# EAGLE design counter-defender-featherwing-mk-1.1 (EAGLE 7.5.0)
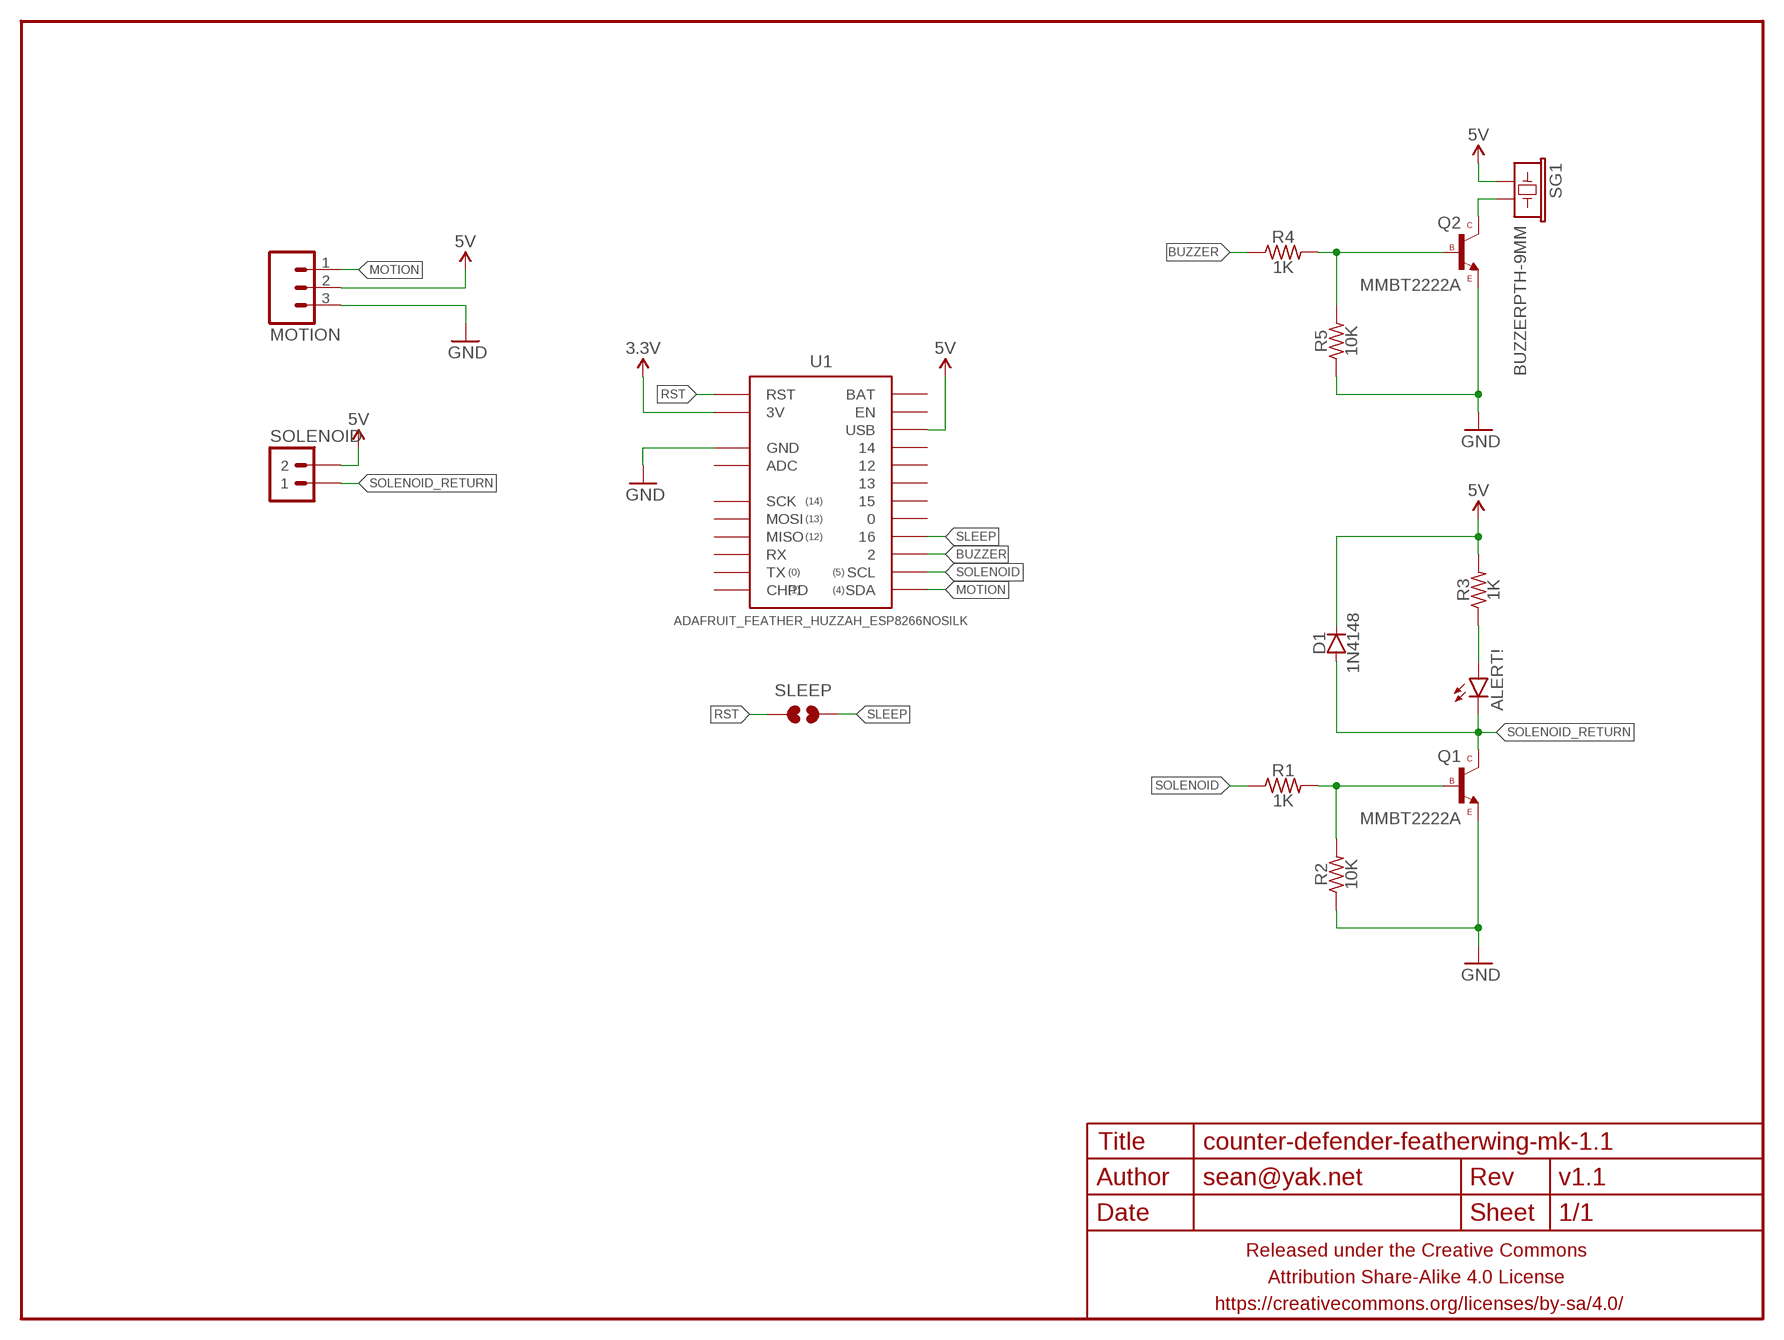
[diagram p0: schematic, sheet 1]

## Parts
ALERT!  LED0603-TIGHT  [LED-0603-TIGHT]
D1  1N4148  DIODESOD123  [SOD123]
FRAME1  FRAME-LETTERNO_PACKAGE  [DUMMY]
MOTION  M03PTH-CENTERED  [1X03-CENTERED]
Q1  MMBT2222A  TRANSISTOR_NPNMMBT2222A  [SOT23]
Q2  MMBT2222A  TRANSISTOR_NPNMMBT2222A  [SOT23]
R1  1K  RESISTORR0603-TIGHTER  [R0603-TIGHTER]
R2  10K  RESISTORR0603-TIGHTER  [R0603-TIGHTER]
R3  1K  RESISTORR0603-TIGHTER  [R0603-TIGHTER]
R4  1K  RESISTORR0603-TIGHTER  [R0603-TIGHTER]
R5  10K  RESISTORR0603-TIGHTER  [R0603-TIGHTER]
SG1  BUZZERPTH-9MM  [BUZZER-PTH-9MM]
SLEEP  JUMPER-PAD-2-NOYES_SILK  [PAD-JUMPER-2-NO_YES_SILK]
SOLENOID  M02PTH-CENTERED  [1X02-CENTER]
U1  ADAFRUIT_FEATHER_HUZZAH_ESP8266NOSILK  [ADAFRUIT_FEATHER_HUZZAH_NOSILK]

## Nets
3.3V: U1.3V
5V: D1.C MOTION.2 R3.2 SG1.+ SOLENOID.2 U1.USB
BUZZER: R4.1 U1.2
GND: MOTION.3 Q1.2(E) Q2.2(E) R2.1 R5.1 U1.GND@0(GND)
MOTION: MOTION.1 U1.SDA
N$1: ALERT!.A R3.1
N$2: Q1.1(B) R1.2 R2.2
N$3: Q2.3(C) SG1.-
N$5: Q2.1(B) R4.2 R5.2
RST: SLEEP.1 U1.RST
SLEEP: SLEEP.2 U1.16
SOLENOID: R1.1 U1.SCL
SOLENOID_RETURN: ALERT!.C D1.A Q1.3(C) SOLENOID.1
Unconnected: U1.0 U1.12 U1.13 U1.14 U1.15 U1.ADC U1.BAT U1.CHPD U1.EN U1.MISO U1.MOSI U1.RX U1.SCK U1.TX

## Library data of the parts
ALERT! = a_parts:LED: LEDs Standard schematic elements and footprints for 5mm, 3mm, 1206, and 0603 sized LEDs. 5mm - Spark Fun Electronics SKU : COM-00529 (and others)
D1 = a_parts:DIODE: Diode These are standard reverse protection diodes and small signal diodes. SMA package can handle up to about 1A. SOD-323 can handle about 200mA. What the SOD-323 package when ordering, there are some mfgs out there that are 5-pin packages.
FRAME1 = a_parts:FRAME-LETTER: Schematic Frame Standard 8.5x11 US Letter frame; DESIGNER: sean@yak.net; VERSION: v1.1
MOTION = a_parts:M03: Header 3 Standard 3-pin 0.1" header. Use with straight break away headers (SKU : PRT-00116), right angle break away headers (PRT-00553), swiss pins (PRT-00743), machine pins (PRT-00117), and female headers (PRT-00115). Molex polarized connector foot print use with SKU : PRT-08232 with associated crimp pins and housings.
Q1 Q2 = a_parts:TRANSISTOR_NPN: Generic NPN BJT MMBT2222A - TRANS-08049 (SOT-23, 1A 40V) MPSA42 - TRANS-09116 (SOT-23, 500mA 300V) MMBT5088LT1G - TRANS-11160 (SOT-23, 50 mA 30V) BC547 - COM-08928 <http://www.sparkfun.com/products/8928> (TO-92 45V 100mA) (1.Collector 2.Base 3.Emitter) 2N3904 - COM-00521 <http://www.sparkfun.com/products/521> (TO-92 40V 200mA) (1.Emitter 2.Base 3.Collector) P2N2222A - COM-12852 <http://www.sparkfun.com/products/12852> (TO-92 40V 600mA) (1.Collector 2.Base 3.Emitter)
R1-R5 = a_parts:RESISTOR: RESISTOR, American symbol
SG1 = a_parts:BUZZER: Buzzer 12mm Spark Fun Electronics SKU : Comp-Buzzer
SLEEP = a_parts:JUMPER-PAD-2-NO
SOLENOID = a_parts:M02: Standard 2-pin 0.1" header. Use with - straight break away headers ( PRT-00116) - right angle break away headers (PRT-00553) - swiss pins (PRT-00743) - machine pins (PRT-00117) - female headers (PRT-00115) Molex polarized connector foot print use with: PRT-08233 with associated crimp pins and housings. 2.54_SCREWTERM for use with PRT-10571. 3.5mm Screw Terminal footprints for PRT-08084 5mm Screw Terminal footprints for use with PRT-08433
U1 = a_parts:ADAFRUIT_FEATHER_HUZZAH_ESP8266

## Board
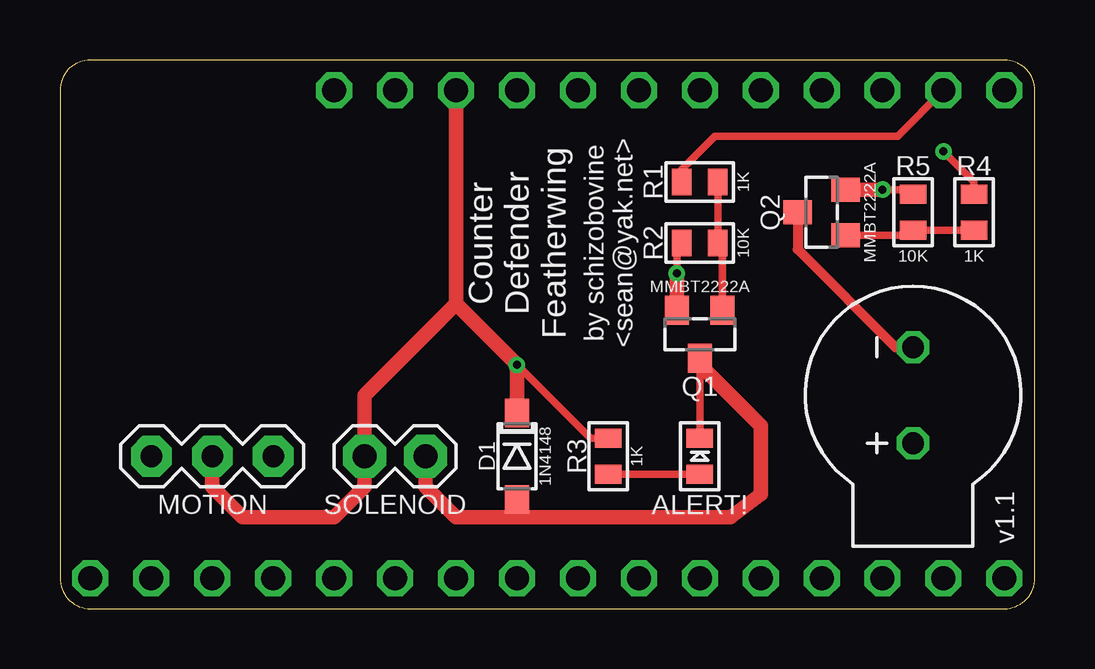
[diagram p1: board, top side]
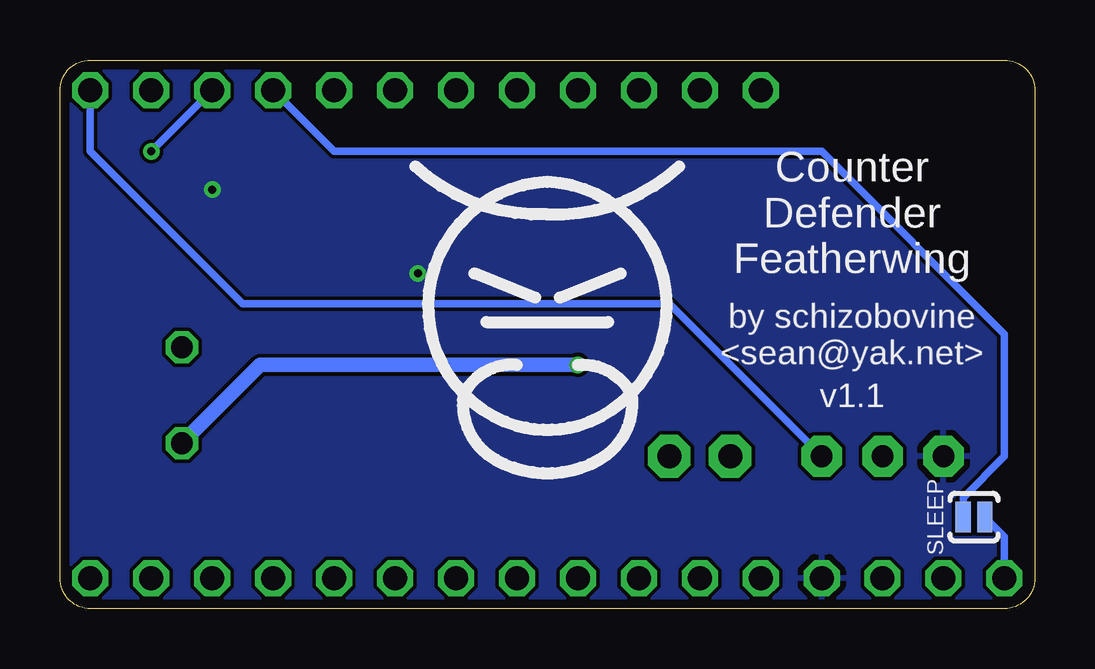
[diagram p2: board, bottom side, seen from below]

Size 40.64 x 22.86 mm. Coordinates in mm from the lower left corner, seen from the top.
Outline: 40.64,1.27 40.64,21.59 arc90 39.37,22.86 1.27,22.86 arc90 0,21.59 0,1.27 arc90 1.27,0 39.37,0 arc90 40.64,1.27
Copper layers (1*16): Top 0.0356mm / dielectric 1.5011mm / Bottom 0.0356mm
Design rules "LaenPCBOrder2": minimum track width 6mil, minimum drill 13mil, track to track 6mil, track to pad 6mil, pad to pad 6mil, via to via 6mil, smd to smd 6mil, copper to edge 15mil, drill to drill 6mil, minimum pad ring 7mil, minimum via ring 7mil, stop-mask expansion 3mil, vias tented up to drill 20mil, thermal gap 10mil

### Footprints (pad centres in the part's own frame; a part is rotated, then mirrored left to right if it is on the bottom)
LED-0603-TIGHT = smd 0.8 x 1.1: A 0.75,0; C -0.75,0
SOD123 = smd 1.2 x 1: A -1.8,0; C 1.8,0
1X03-CENTERED = drill 0.9 pad 1.7 octagon: 1 -2.54,0; 2 0,0; 3 2.54,0
SOT23 = smd 1 x 1.2: 1 -0.95,-1; 2 0.95,-1; 3 0,1
R0603-TIGHTER = smd 0.8 x 1.1: 1 -0.75,0; 2 0.75,0
BUZZER-PTH-9MM = drill 0.9 octagon: + -2,0; - 2,0
PAD-JUMPER-2-NO_YES_SILK = smd 0.635 x 1.27: 1 -0.45,0; 2 0.45,0
1X02-CENTER = drill 1 pad 1.778 octagon: 1 -1.27,0; 2 1.27,0
ADAFRUIT_FEATHER_HUZZAH_NOSILK = drill 1 pad 1.5 octagon: 0 8.89,10.16; 2 13.97,10.16; 3V -16.51,-10.16; 12 1.27,10.16; 13 3.81,10.16; 14 -1.27,10.16; 15 6.35,10.16; 16 11.43,10.16; ADC -8.89,-10.16; BAT -8.89,10.16; CHPD 19.05,-10.16; EN -6.35,10.16; GND@0 -11.43,-10.16; MISO 11.43,-10.16; MOSI 8.89,-10.16; NC@3 -13.97,-10.16; NC@6 -6.35,-10.16; NC@7 -3.81,-10.16; NC@8 -1.27,-10.16; NC@9 1.27,-10.16; NC@10 3.81,-10.16; RST -19.05,-10.16; RX 13.97,-10.16; SCK 6.35,-10.16; SCL 16.51,10.16; SDA 19.05,10.16; TX 16.51,-10.16; USB -3.81,10.16

### Placement (x,y rotation side)
ALERT!  26.67,6.35 270 top
D1  19.05,6.35 90 top
FRAME1  0,0 0 top
MOTION  6.35,6.35 180 top
Q1  26.67,11.43 180 top
Q2  31.75,16.51 90 top
R1  26.67,17.78 0 top
R2  26.67,15.24 0 top
R3  22.86,6.35 90 top
R4  38.1,16.51 270 top
R5  35.56,16.51 270 top
SG1  35.56,8.89 90 top
SLEEP  2.54,3.81 180 bottom
SOLENOID  13.97,6.35 180 top
U1  20.32,11.43 0 top
U$1  [COW]  20.32,11.43 0 bottom

### Tracks (layer width: path | path; a pad name or v marks a point on that pad's centre or on a via)
5V  (via drill 0.33)
  Top 0.305: R3.2 22.11,7.1 v19.05,10.16
  Top 0.61: U1.USB 16.51,12.7 | 16.51,12.7 12.7,8.89 SOLENOID.2 12.7,5.08 11.43,3.81 7.62,3.81 6.35,5.08 MOTION.2 | D1.C v19.05,10.16 16.51,12.7
  Bottom 0.61: SG1.+ 32.29,10.16 v19.05,10.16
BUZZER  (via drill 0.33)
  Top 0.305: v36.83,19.05 38.1,17.78 R4.1
  Bottom 0.305: U1.2 v36.83,19.05
GND  (via drill 0.33)
  Top 0.305: R2.1 25.72,15.04 v25.72,13.97 | R5.1 35.36,17.46 v34.29,17.46
  Top 0.61: Q1.2 v25.72,13.97 | Q2.2 v34.29,17.46
  pour Bottom (rank 6): 0,21.59 0,1.27 arc90 1.27,0 39.37,0 arc90 40.64,1.27 40.64,21.59 arc90 39.37,22.86 1.27,22.86 arc90
MOTION
  Bottom 0.305: U1.SDA 39.37,19.05 33.02,12.7 15.24,12.7 MOTION.1
N$1
  Top 0.305: R3.1 ALERT!.A
N$2
  Top 0.305: Q1.1 27.62,15.04 R2.2 R1.2
N$3
  Top 0.406: Q2.3 30.75,14.97 34.83,10.89 SG1.-
N$5
  Top 0.305: Q2.1 35.36,15.56 R5.2 R4.2
RST
  Bottom 0.305: U1.RST 1.27,2.99 SLEEP.1
SLEEP
  Bottom 0.305: U1.16 29.21,19.05 8.89,19.05 1.27,11.43 1.27,6.35 2.99,4.63 SLEEP.2
SOLENOID
  Top 0.305: U1.SCL 34.92,19.68 27.3,19.68 25.92,18.3 R1.1
SOLENOID_RETURN
  Top 0.305: ALERT!.C 26.67,10.16
  Top 0.61: SOLENOID.1 15.24,5.08 16.51,3.81 19.05,3.81 | D1.A 19.05,3.81 | Q1.3 26.67,10.16 29.21,7.62 29.21,4.76 27.94,3.81 19.05,3.81

### Text on the board
tPlace: Counter / Defender / Featherwing | by schizobovine / <sean@yak.net>
bPlace: Counter / Defender / Featherwing | by schizobovine / <sean@yak.net>